# Altium schematic sheet Lab_8_v3.SchDoc
size A3; SheetNumber: 1; SheetTotal: 1
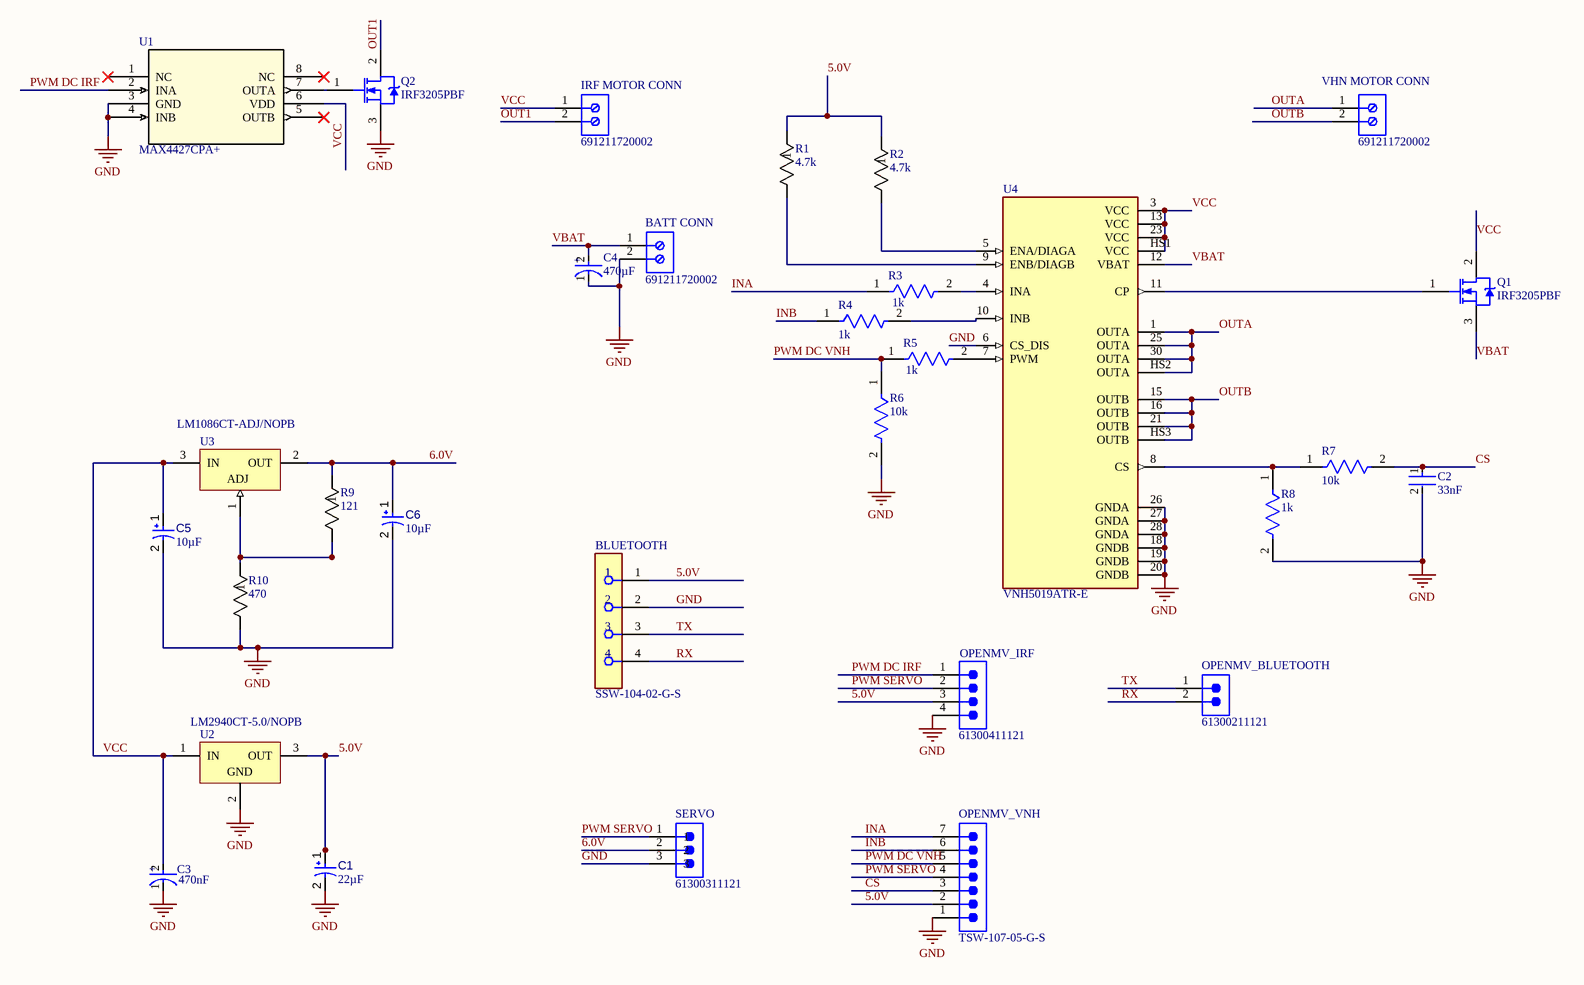
[diagram p0: Lab_8_v3.SchDoc]

## Parts
BATT_CONN  691211720002  [691211720002]
BLUETOOTH  SSW-104-02-G-S  [FP-SSW-104-02-G-S-MFG]
C1  value 22µF  [CAPPR55-200-1100X500X1200]  (hidden comment: ECA1HM220)
C2  33nF  [FP-565R30GASS33-MFG]
C3  value 470nF  [FP-RAD-TH-D_5_0_5-L_11_1-MFG]  (hidden comment: EEU-EB1JR47S)
C4  value 470µF  [FP-MAL202136471E3-MFG]  (hidden comment: MAL202136471E3)
C5  value 10µF  [CAPPR55-200-1100X500X1200]  (hidden comment: ECA1HM100)
C6  value 10µF  [CAPPR55-200-1100X500X1200]  (hidden comment: ECA1HM100)
IRF_MOTOR_CONN  691211720002  [691211720002]
OPENMV_BLUETOOTH  61300211121  [61300211121]
OPENMV_IRF  61300411121  [61300411121]
OPENMV_VNH  TSW-107-05-G-S  [SMTC-TSW-107-05-X-S]
Q1  IRF3205PBF  [INF-PG-TO-220AB]
Q2  IRF3205PBF  [INF-PG-TO-220AB]
R1  value 4.7k  [ERL05_VIS]  (hidden comment: RLR05C4701GRB14)
R2  value 4.7k  [ERL05_VIS]  (hidden comment: RLR05C4701GRB14)
R3  1k  [FP-RLR07-MFG]
R4  1k  [FP-RLR07-MFG]
R5  1k  [FP-RLR07-MFG]
R6  value 10k  [FP-CF18-MFG]  (hidden comment: CF18JT10K0)
R7  value 10k  [FP-CF18-MFG]  (hidden comment: CF18JT10K0)
R8  1k  [FP-RLR07-MFG]
R9  value 121  [SFR16S_VIS]  (hidden comment: SFR16S0001210FR500)
R10  value 470  [RES_AC03_VIS]  (hidden comment: AC03000004700JAC00)
SERVO  61300311121  [61300311121]
U1  MAX4427CPA+  [21-0043_P8+2_MXM]
U2  LM2940CT-5.0/NOPB  [NDE0003A]
U3  LM1086CT-ADJ/NOPB  [NDE0003A]
U4  VNH5019ATR-E  [IC_VNH5019ATR-E]
VHN_MOTOR_CONN  691211720002  [691211720002]

## Nets
GND: BATT_CONN.2 BLUETOOTH.2 C1.2 C2.2 C3.1(C) C4.1(C) C5.2 C6.2 OPENMV_IRF.4 OPENMV_VNH.1 Q2.3(S) R6.2 R8.2 R10.2 SERVO.3 U1.3(GND) U1.4(INB) U2.2(GND) U4.6(CS_DIS) U4.18(GNDB) U4.19(GNDB) U4.20(GNDB) U4.26(GNDA) U4.27(GNDA) U4.28(GNDA)
5.0V: BLUETOOTH.1 C1.1 OPENMV_IRF.3 OPENMV_VNH.2 R1.1 R2.1 U2.3(OUT)
6.0V: C6.1 R9.1 SERVO.2 U3.2(OUT)
CS: C2.1 OPENMV_VNH.3 R7.2
INA: OPENMV_VNH.7 R3.1
INB: OPENMV_VNH.6 R4.1
OUT1: IRF_MOTOR_CONN.2 Q2.2(D)
OUTA: U4.1(OUTA) U4.25(OUTA) U4.30(OUTA) U4.HS2(OUTA) VHN_MOTOR_CONN.1
OUTB: U4.15(OUTB) U4.16(OUTB) U4.21(OUTB) U4.HS3(OUTB) VHN_MOTOR_CONN.2
PWM DC IRF: OPENMV_IRF.1 U1.2(INA)
PWM DC VNH: OPENMV_VNH.5 R5.1 R6.1
PWM SERVO: OPENMV_IRF.2 OPENMV_VNH.4 SERVO.1
RX: BLUETOOTH.4 OPENMV_BLUETOOTH.2
TX: BLUETOOTH.3 OPENMV_BLUETOOTH.1
VBAT: BATT_CONN.1 C4.2(A) Q1.3(S) U4.12(VBAT)
VCC: C3.2(A) C5.1 IRF_MOTOR_CONN.1 Q1.2(D) U1.6(VDD) U2.1(IN) U3.3(IN) U4.3(VCC) U4.13(VCC) U4.23(VCC) U4.HS1(VCC)
NetQ1_1: Q1.1(G) U4.11(CP)
NetQ2_1: Q2.1(G) U1.7(OUTA)
NetR1_2: R1.2 U4.9(ENB/DIAGB)
NetR2_2: R2.2 U4.5(ENA/DIAGA)
NetR3_2: R3.2 U4.4(INA)
NetR4_2: R4.2 U4.10(INB)
NetR5_2: R5.2 U4.7(PWM)
NetR7_1: R7.1 R8.1 U4.8(CS)
NetR9_2: R9.2 R10.1 U3.1(ADJ)

Not connected (* = marked no-connect by the designer): U1 1(NC)* 5(OUTB)* 8(NC)*

## Notes on the sheet
- (in symbol CMP-001-00083-2) +
- (in symbol CMP-001-00093-1) +

## Library data of the parts
BATT_CONN IRF_MOTOR_CONN = CMP-1502-02524-2: NexarPartId: 8917714; Number of Positions Per Level: 2; Wire Gauge (Min): 12AWG; Voltage: 300V; Connector Type: PCB, Terminal Block; Pitch: 5.0038mm; Current: 10A; Number of Levels: 1; Wire Gauge (Max): 24AWG; Plating: Brass, Steel; Stripping Length: -7mm; Width: 10mm; Min Operating Temperature: -40°C; Mount: Through Hole; Lead Pitch: 5mm; Max Operating Temperature: 105°C; Packaging: Box; Number of Contacts: 2; Length: 13.7mm; Height: 15.5mm; Color: Green; Number of Pins: 2; Wire/Cable Gauge: 12AWG; Housing Material: Nylon; REACH SVHC: Unknown; Contact Plating: Tin; RoHS: Compliant; Contact Material: Brass; Termination: Screw
BLUETOOTH = CMP-002-00079-1: Board Connector, 4 Contact(s), 1 Row(s), Female, Straight, 0.1 inch Pitch, Solder Terminal, Locking, Socket; Manufacturer Series: SSW-1; Mating Information: MULTIPLE MATING PARTS AVAILABLE; Body Length: 0.42inch; MIL Conformance: No; Reference Standard: UL; Number of Contacts: 4; Plating Thickness: 20uin; Number of Rows Loaded: 1; Additional Feature: TIGER BUY CONTACT; Contact Style: SQ PIN-SKT; Contact Pattern: RECTANGULAR; Reliability: COMMERCIAL; Body Breadth: 0.095inch; Option: General Purpose; Contact Finish - Mating: GOLD (20) OVER NICKEL (50); Body/Shell Style: SOCKET; Terminal Pitch: 2.54mm; Mounting Style: STRAIGHT; Contact Gender: Female; Contact Material: Bronze; IEC Conformance: No; Mixed Contacts: No; JESD-609 Code: e4; Connector Type: BOARD CONNECTOR; Termination: Solder; Flammability Rating: UL94 V-0; Reach SVHC Compliant: Yes; RoHS Compliant: Yes; Contact Finish - Termination: Gold (Au) - with Nickel (Ni) barrier; Number Of PCB Rows: 1; Insulation Material: Polymer; Number Of Connectors: 1; DIN Conformance: No; Mating Contact Pitch: 0.1inch; Mounting Technology: Board; Mounting Option 1: LOCKING; PCB Contact Pattern: RECTANGULAR; Filter Feature: No
C1 = CMP-001-00027-7: Aluminum Electrolytic Capacitor, 22 uF, +/- 20%, 50 V, -40 to 85 degC, 2-Pin THD, RoHS, Bulk; Manufacturer: Panasonic; Ripple Current (AC): 100mA; Voltage Rating: 50V; Pins: 2; Case/Package: Radial; Datasheet Version: Rev. 05, 10/2016; RoHS Compliant: True; Max Operating Temperature: 85°C; Ripple Current: 100mA; Capacitor Type: Electrolytic; Mounting Technology: TH; Package Quantity: 200; Package Reference: CAPPR55-200-1100X500X1200; Package Description: 2-Pin Radial Lead, Dia 5 mm, Height 12 mm; Packaging: Bulk; Lead Pitch: 2mm; Min Operating Temperature: -40°C; Diameter: 5mm; Tolerance: 20%; Datasheet URL: https://industrial.panasonic.com/cdbs/www-data/pdf/RDF0000/ABA0000C1218.pdf; Manufacturer URL: http://www.panasonic.com/
C2 = CMP-00030-41968055-1: 565R30GASS33 33nF 3 kV dc Ceramic Single Layer Capacitor; Z5U Dielectric Radial 565R Series; Voltage: 3kV; Tolerance: 20%; Lead Diameter: 640µm; Diameter: 22.9mm; Lead Free: Lead Free; Material: Ceramic; Schedule B: 8532230060; Depth: 6.1mm; Mount: Radial; Max Operating Temperature: 105°C; Capacitance: 33nF; Composition: Ceramic; RoHS: Compliant; Min Operating Temperature: -25°C; Dielectric: Z5U; NexarPartId: 41968055; Height: 22.9mm; Voltage Rating: 3kV; Lead Pitch: 9.52mm; Termination: Radial; Packaging: Bulk; Case/Package: Radial; Voltage Rating (DC): 3kV
C3 = CMP-001-00093-1: Aluminum Electrolytic Capacitor, Polarized, Aluminum (wet), 63V, 20% +Tol, 20% -Tol, 0.47uF, Through Hole Mount; Manufacturer Series: EB; Capacitor Type: Aluminium; Leakage Current: 3uA; Tan Delta: 0.12; Ripple Current: 4.5mA; Diameter: 5mm; Series: EEU-EB; Package Shape: Cylindrical; Termination: Wire; Mounting Technology: Through Hole; JESD-609 Code: e3; Dielectric Material: Aluminium; Terminal Finish: Tin; RoHS Compliant: Yes; Tolerance (fill in as +-): 20%; Rated DC Voltage (URdc): 63V; Terminal Pitch: 2mm; Polarity: Polarized; Max Operating Temperature: 105°C; Pins: 2; Packaging: Bulk; Min Operating Temperature: -40°C; Tolerance  (fill in as +-): 20%; Reach SVHC Compliant: Yes; Length: 11mm; Package Style: RadialMeter
C4 = CMP-001-00083-2: Aluminum Electrolytic Capacitor, Polarized, Aluminum (wet), 25V, 20% +Tol, 20% -Tol, 470uF, Through Hole Mount; ESR (Equivalent Series Resistance): 480mR; Capacitor Type: Aluminium; Tan Delta: 0.14; Ripple Current: 450mA; Leakage Current: 28uA; Length: 18mm; Reach SVHC Compliant: Yes; Pins: 2; Package Shape: Tubular; JESD-609 Code: e3; Terminal Finish: Tin; Min Operating Temperature: -40°C; Tolerance  (fill in as +-): 20%; RoHS Compliant: Yes; Packaging: Ammo Pack; Polarity: Polarized; Dielectric Material: Aluminium; Max Operating Temperature: 85°C; Rated DC Voltage (URdc): 25V; Tolerance (fill in as +-): 20%; Package Style: AxialMeter; Diameter: 10mm; Mounting Technology: Through Hole; Termination: Wire
C5 C6 = CMP-001-00025-7: Aluminum Electrolytic Capacitor, 10 uF, +/- 20%, 50 V, -40 to 85 degC, 2-Pin THD, RoHS, Bulk; Manufacturer: Panasonic; Ripple Current (AC): 65mA; Voltage Rating: 50V; Mounting Technology: TH; RoHS Compliant: True; Capacitor Type: Electrolytic; Datasheet Version: Rev. 05, 10/2016; Min Operating Temperature: -40°C; Packaging: Bulk; Ripple Current: 65mA; Tolerance: 20%; Max Operating Temperature: 85°C; Datasheet URL: https://industrial.panasonic.com/cdbs/www-data/pdf/RDF0000/ABA0000C1218.pdf; Lead Pitch: 2mm; Pins: 2; Diameter: 5mm; Manufacturer URL: http://www.panasonic.com/; Package Reference: CAPPR55-200-1100X500X1200; Package Description: 2-Pin Radial Lead, Dia 5 mm, Height 12 mm; Case/Package: Radial; Package Quantity: 200
OPENMV_BLUETOOTH = CMP-002-00073-1: Board Connector, 2 Contact(s), 1 Row(s), Male, Straight, 0.1 inch Pitch, Solder Terminal, Locking, Black Insulator, Plug; Reference Standard: UL; Body Length: 0.2inch; Filter Feature: No; Contact Resistance: 20mR; Insulation Resistance: 1GR; Dielectric Withstanding Voltage (AC): 500V; Number of Rows Loaded: 1; Reliability: COMMERCIAL; Contact Pattern: RECTANGULAR; Rated Current (Signal): 3A; Option: General Purpose; Contact Style: SQ PIN-SKT; Number of Contacts: 2; Insulation Material: Polybutylene; Insulation Color: Black; Reach SVHC Compliant: Yes; Mounting Style: STRAIGHT; RoHS Compliant: Yes; Mounting Technology: Board; Connector Type: BOARD CONNECTOR; Contact Gender: Male; Flammability Rating: UL94 V-0; Max Operating Temperature: 125°C; DIN Conformance: No; Body Breadth: 0.1inch; Mounting Option 1: LOCKING; Termination: Solder; Terminal Length: 0.118inch; Contact Finish - Termination: Gold (Au) - with Nickel (Ni) barrier; JESD-609 Code: e4; Body Depth: 0.1inch; PCB Contact Pattern: RECTANGULAR; Body/Shell Style: PLUG; Mating Contact Pitch: 0.1inch; MIL Conformance: No; Contact Material: Copper Alloy; IEC Conformance: No; Mixed Contacts: No; Terminal Pitch: 2.54mm; Min Operating Temperature: -40°C; Contact Finish - Mating: GOLD; Number Of Connectors: 1
OPENMV_IRF = CMP-00009-2: Board Connector, 4 Contact(s), 1 Row(s), Male, Straight, 0.1 inch Pitch, Solder Terminal, Locking, Black Insulator, Plug; Body Length: 0.4inch; Dielectric Withstanding Voltage (AC): 500V; Rated Current (Signal): 3A; Insulation Resistance: 1GR; Reliability: COMMERCIAL; Contact Style: SQ PIN-SKT; Number of Rows Loaded: 1; Reference Standard: UL; Number of Contacts: 4; Contact Resistance: 20mR; Contact Pattern: RECTANGULAR; Max Operating Temperature: 125°C; Contact Finish - Mating: GOLD; Mating Contact Pitch: 0.1inch; Mounting Technology: Board; Mounting Style: STRAIGHT; JESD-609 Code: e4; Body Depth: 0.1inch; Contact Material: Copper Alloy; Reach SVHC Compliant: Yes; Terminal Pitch: 2.54mm; Min Operating Temperature: -40°C; Connector Type: BOARD CONNECTOR; Insulation Color: Black; Contact Gender: Male; Terminal Length: 0.118inch; RoHS Compliant: Yes; Termination: Solder; Body/Shell Style: PLUG; Body Breadth: 0.1inch; PCB Contact Pattern: RECTANGULAR; Mounting Option 1: LOCKING; Insulation Material: Polybutylene; Contact Finish - Termination: Gold (Au) - with Nickel (Ni) barrier; Number Of Connectors: 1
OPENMV_VNH = CMP-002-00080-1: Board Connector, 7 Contact(s), 1 Row(s), Male, Straight, 0.1 inch Pitch, Solder Terminal, Black Insulator; Mixed Contacts: No; Mating Information: MULTIPLE MATING PARTS AVAILABLE; Number of Rows Loaded: 1; Contact Style: SQ PIN-SKT; Number of Contacts: 7; Option: General Purpose; Reliability: COMMERCIAL; Reference Standard: UL; Contact Pattern: RECTANGULAR; Plating Thickness: 10uin; Additional Feature: E.L.P.; Insulation Material: Polybutylene; Contact Finish - Termination: Gold (Au) - with Nickel (Ni) barrier; RoHS Compliant: Yes; Terminal Length: 0.13inch; Insulation Color: Black; Flammability Rating: UL94 V-0; Mating Contact Pitch: 0.1inch; Terminal Pitch: 2.54mm; Number Of Connectors: 1; Mounting Style: STRAIGHT; Reach SVHC Compliant: Yes; Body Depth: 0.1inch; Contact Gender: Male; Connector Type: BOARD CONNECTOR; Number Of PCB Rows: 1; Filter Feature: No; MIL Conformance: No; IEC Conformance: No; PCB Contact Pattern: RECTANGULAR; DIN Conformance: No; Contact Finish - Mating: GOLD (10) OVER NICKEL (50); JESD-609 Code: e4; Body Breadth: 0.1inch; Contact Material: Bronze; Mounting Technology: Board; Termination: Solder
Q1 Q2 = CMP-00000-1: Power Field-Effect Transistor, 75A I(D), 55V, 0.008ohm, 1-Element, N-Channel, Silicon, Metal-oxide Semiconductor FET, TO-220AB; Number of Elements: 1; Drain-source On Resistance-Max: 8mR; Avalanche Energy Rating (Eas): 264mJ; Case Connection: DRAIN; Operating Mode: ENHANCEMENT MODE; Pulsed Drain Current-Max (IDM): 390A; Qualification Status: Not Qualified; Transistor Application: SWITCHING; Package Body Material: Plastic; Power Dissipation-Max (Abs): 200W; Time @ Peak Reflow Temperature-Max (s): 30s; Surface Mount: No; Drain Current-Max (Abs) (ID): 110A; JESD-30 Code: R-PSFM-T3; Transistor Element Material: SILICON; Pins: 3; JEDEC-95 Code: TO-220AB; RoHS Compliant: Yes; Max Operating Temperature: 175°C; Terminal Form: Through Hole; Drain Current-Max (ID): 75A; Terminal Position: SINGLE; Terminal Finish: Nickel; Package Style: FLANGE MOUNTMeter; DS Breakdown Voltage-Min: 55V; JESD-609 Code: e3; Package Shape: Rectangular; FET Technology: METAL-OXIDE SEMICONDUCTOR; Peak Reflow Temperature (Cel): 250°C; Polarity/Channel Type: N-CHANNEL
R1 R2 = CMP-009-00185-6: Fixed Resistor, Metal Film, 0.125W, 4700ohm, 200V, 2% +/-Tol, 100ppm/Cel, Through Hole Mount; Mfr_Name: Vishay; Lead Diameter: 0.41mm; Package Length: 3.81mm; Rated Temperature: 70°C; Lead Length: 31.75mm; Temperature Coefficient (ppm/Cel): 100; Power: 125mW; Reference Standard: MIL-PRF-39017; Tolerance: 2%; Technology: METAL FILM; Package Style: AXIAL; Pins: 2; Max Operating Temperature: 150°C; Min Operating Temperature: -65°C; Termination: Wire; Resistor Type: FIXED RESISTOR; Reach SVHC Compliant: No; RoHS Compliant: No; Design Item ID: RLR05C4701GRB14; Construction: Tubular; Terminal Finish: Tin; Source: RLR05C4701GRB14.SchLib; Packaging: Bulk; JESD-609 Code: e0; Mounting Technology: Through Hole; Working Voltage: 200V; Package Shape: Tubular
R3-R5 R8 = CMP-00030-39447724-1: RLR07C1001FSB14 Fixed Resistor, Metal Film, 0.25W, 1000ohm, 250V, 1% +/-Tol, 100ppm/Cel, Through Hole Mount; Wire/Cable Diameter: 50.8µm; Lead Diameter: 640µm; Max Power Dissipation: 250mW; Temperature Coefficient: 100ppm/°C; Resistance: 1kΩ; Lead Length: 38.1mm; Voltage Rating: 250V; Lead Free: Contains Lead; REACH SVHC: Unknown; Packaging: Bulk; Military Standard: MIL-PRF-39017; Width: 2.29mm; Max Operating Temperature: 150°C; Length: 7.62mm; Min Operating Temperature: -65°C; Composition: Metal Film; Diameter: 2.29mm; Radiation Hardening: No; Features: Military, Moisture Resistant, Weldable; Failure Rate: 0.001%; Case/Package: Conformal; Tolerance: 1%; Voltage Rating (DC): 250V; Schedule B: 8533210090, 8533210090; RoHS: Non-Compliant; Termination: Axial; Power Rating: 250mW; Contact Plating: Lead, Tin; NexarPartId: 39447724; Number of Terminations: 2; Number of Pins: 14
R6 R7 = CMP-00016-1: Fixed Resistor, Carbon Film, 0.125W, 10000ohm, 250V, 5% +/-Tol, -500,0ppm/Cel, Through Hole Mount; Rated Temperature: 70°C; Package Length: 3.3mm; Power: 125mW; Lead Length: 28mm; Temperature Coefficient (ppm/Cel): 500; Lead Diameter: 0.4mm; Max Operating Temperature: 155°C; Reach SVHC Compliant: Yes; Package Style: AXIAL; JESD-609 Code: e3; Tolerance: 5%; Packaging: Tape and Reel; Construction: Tubular; RoHS Compliant: Yes; Resistor Type: FIXED RESISTOR; Mounting Technology: Through Hole; Working Voltage: 250V; Min Operating Temperature: -55°C; Package Shape: Tubular; Technology: CARBON FILM; Pins: 2; Termination: Wire; Terminal Finish: Tin
R9 = CMP-009-00182-5: Fixed Resistor, Metal Film, 0.5W, 121ohm, 200V, 1% +/-Tol, 100ppm/Cel, Through Hole Mount; Mfr_Name: Vishay; Package Length: 3.5mm; Power: 500mW; Rated Temperature: 70°C; Temperature Coefficient (ppm/Cel): 100; Lead Diameter: 0.45mm; Min Operating Temperature: -55°C; Packaging: Tape and Reel; Tolerance: 1%; Mounting Technology: Through Hole; RoHS Compliant: Yes; Terminal Finish: Tin; Technology: METAL FILM; Max Operating Temperature: 155°C; Resistor Type: FIXED RESISTOR; Voltage Rating: 200V; Pins: 2; Construction: Tubular; Working Voltage: 200V; Source: SFR16S0001210FR500.SchLib; JESD-609 Code: e3; Package Style: AXIAL; Package Shape: Tubular; Design Item ID: SFR16S0001210FR500; Termination: Wire; Reach SVHC Compliant: Yes
R10 = CMP-009-00184-1: Fixed Resistor, Wire Wound, 3W, 470ohm, 37.55V, 5% +/-Tol, 100,180ppm/Cel, Through Hole Mount; Package Length: 13mm; Temperature Coefficient (ppm/Cel): 180; Rated Temperature: 40°C; Lead Diameter: 0.8mm; Additional Feature: FLAME PROOF; RoHS Compliant: Yes; Max Operating Temperature: 250°C; Resistor Type: FIXED RESISTOR; Construction: Tubular; Terminal Finish: Tin; Tolerance: 5%; Termination: Wire; Technology: WIRE WOUND; Min Operating Temperature: -55°C; Mounting Technology: Through Hole; Package Shape: Tubular; Packaging: Ammo Pack; Package Style: AXIAL; JESD-609 Code: e3; Power: 3W; Reach SVHC Compliant: Yes; Pins: 2
SERVO = CMP-00010-2: Board Connector, 3 Contact(s), 1 Row(s), Male, Straight, 0.1 inch Pitch, Solder Terminal, Locking, Black Insulator, Plug; Rated Current (Signal): 3A; Number Of Connectors: 1; Number of Contacts: 3; Contact Resistance: 20mR; Contact Pattern: RECTANGULAR; Dielectric Withstanding Voltage (AC): 500V; Reliability: COMMERCIAL; Contact Style: SQ PIN-SKT; Body Length: 0.3inch; Reference Standard: UL; Insulation Resistance: 1GR; Contact Material: Copper Alloy; Contact Finish - Termination: Gold (Au) - with Nickel (Ni) barrier; RoHS Compliant: Yes; Mating Contact Pitch: 0.1inch; Body Breadth: 0.1inch; Mounting Style: STRAIGHT; Contact Finish - Mating: GOLD; Terminal Pitch: 2.54mm; JESD-609 Code: e4; Reach SVHC Compliant: Yes; Mounting Technology: Board; Body Depth: 0.1inch; Body/Shell Style: PLUG; Contact Gender: Male; Insulation Material: Polybutylene; Number of Rows Loaded: 1; Insulation Color: Black; Termination: Solder; PCB Contact Pattern: RECTANGULAR; Min Operating Temperature: -40°C; Terminal Length: 0.118inch; Connector Type: BOARD CONNECTOR; Mounting Option 1: LOCKING; Max Operating Temperature: 125°C
U1 = CMP-003-000001-1: No Description Available; Mfr_Name: Analog Devices Inc; RefDes: RefDes; Type: Type; Design Item ID: MAX4427CPA+; Source: MAX4427CPA&plus_.SchLib
U2 = CMP-00005-1: Fixed Positive LDO Regulator, 5V, 1V Dropout, BIPolar, PSFM3; Number of Outputs: 1; Output Current1-Max: 1A; Surface Mount: No; Regulator Type: FIXED POSITIVE SINGLE OUTPUT LDO REGULATOR; Max Supply Voltage: 26V; Time @ Peak Reflow Temperature-Max (s): 40s; Package Equivalence Code: SIP3,.1TB; Qualification Status: Not Qualified; Package Body Material: Plastic; Voltage Tolerance-Max: 5%; Output Voltage1-Max: 5.25V; Dropout Voltage1-Nom: 500mV; Output Voltage1-Min: 4.75V; Min Input Voltage: 6.25V; Input Voltage Absolute-Max: 45V; Operating Temperature, TJ-Max: 125°C; Dropout Voltage1-Max: 1V; Moisture Sensitivity Level: 1; Terminal Finish: Tin; Package Shape: Rectangular; Technology: BIPOLAR; RoHS Compliant: Yes; JESD-30 Code: R-PSFM-T3; Terminal Pitch: 2.54mm; Min Operating Temperature: -40°C; Peak Reflow Temperature (Cel): 260°C; JESD-609 Code: e3; Reach SVHC Compliant: Yes; Adjustability: FIXED; Output Voltage1-Nom: 5V; Operating Temperature, TJ-Min: 0°C; Max Operating Temperature: 125°C; Channels: 1; Terminal Position: SINGLE; Pins: 3; Terminal Form: Through Hole
U3 = CMP-00006-1: Adjustable Positive LDO Regulator, 1.2V Min, 15V Max, 1.5V Dropout, BIPolar, PSFM3; Number of Outputs: 1; Line Regulation-Max (%/V): 0.01; Dropout Voltage1-Nom: 1.3V; Package Equivalence Code: SIP3,.1TB; Surface Mount: No; Qualification Status: Not Qualified; Output Current1-Max: 1.5A; Load Regulation-Max(%): 0.4%; Regulator Type: ADJUSTABLE POSITIVE SINGLE OUTPUT LDO REGULATOR; Package Body Material: Plastic; Input-Output Voltage Differential-Min: 1.5V; Reach SVHC Compliant: Yes; Operating Temperature, TJ-Max: 125°C; RoHS Compliant: Yes; Channels: 1; Package Shape: Rectangular; Input-Output Voltage Differential-Max: 15V; Package Style: FLANGE MOUNTMeter; Dropout Voltage1-Max: 1.5V; Moisture Sensitivity Level: 1; JESD-30 Code: R-PSFM-T3; Terminal Pitch: 2.54mm; Packaging: Rail/Tube; Technology: BIPOLAR; Adjustability: ADJUSTABLE; Terminal Finish: Tin; Output Voltage1-Max: 15V; Output Voltage1-Min: 1.2V; JESD-609 Code: e3; Terminal Form: Through Hole; Case/Package: TO-220; Operating Temperature, TJ-Min: 0°C; Pins: 3; Terminal Position: SINGLE
U4 = CMP-00024-00006-1: Motor Driver Power MOSFET Parallel, PWM MultiPowerSO-30; MF: STMicroelectronics; SnapEDA_Link: https://www.snapeda.com/parts/VNH5019ATR-E/STMicroelectronics/view-part/423747/?ref=snap; Design Item ID: VNH5019ATR-E; Case/Package: SOP-30 STMicroelectronics; Availability: Unavailable; MP: VNH5019ATR-E; Component Type: Standard; Price: None; Pins: 27; Source: SnapEDAsch.SchLib; Value: *
VHN_MOTOR_CONN = CMP-00030-00001-1: Barrier Strip Terminal Block; RoHS Compliant: Yes